# EAGLE design Encoder (EAGLE 6.5.0)
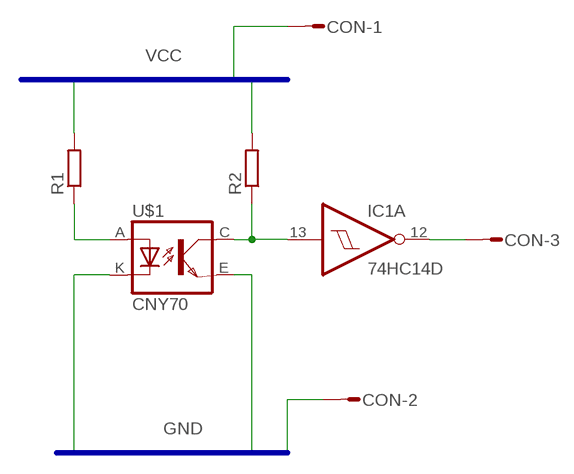
[diagram p0: schematic, sheet 1]

## Parts
CON  L03P  [L03P]
IC1  74HC14D  [SO14]
R1  R-EU_M1206  [M1206]
R2  R-EU_M1206  [M1206]
U$1  CNY70  [4]

## Nets
GND: CON.2 U$1.E(EMI) U$1.K(C)
N$1: R1.1 U$1.A
N$2: IC1.13(A:I) R2.1 U$1.C(COL)
N$3: CON.3 IC1.12(A:O)
VCC: CON.1 R1.2 R2.2
Unconnected: IC1.1(D:I) IC1.2(D:O) IC1.3(E:I) IC1.4(E:O) IC1.5(F:I) IC1.6(F:O) IC1.8(C:O) IC1.9(C:I) IC1.10(B:O) IC1.11(B:I)

## Buses
VCC
GND

## Power pins joined to a net without a drawn wire
GND: IC1.7(P:GND)
VCC: IC1.14(P:VCC)

## Library data of the parts
CON = con-amp-mt:L03P: AMP MT CONNECTOR
IC1 = 74xx-eu:74*14: Hex schmitt trigger INVERTER
R1 R2 = rcl:R-EU_: RESISTOR, European symbol
U$1 = cny70:CNY70

## Board
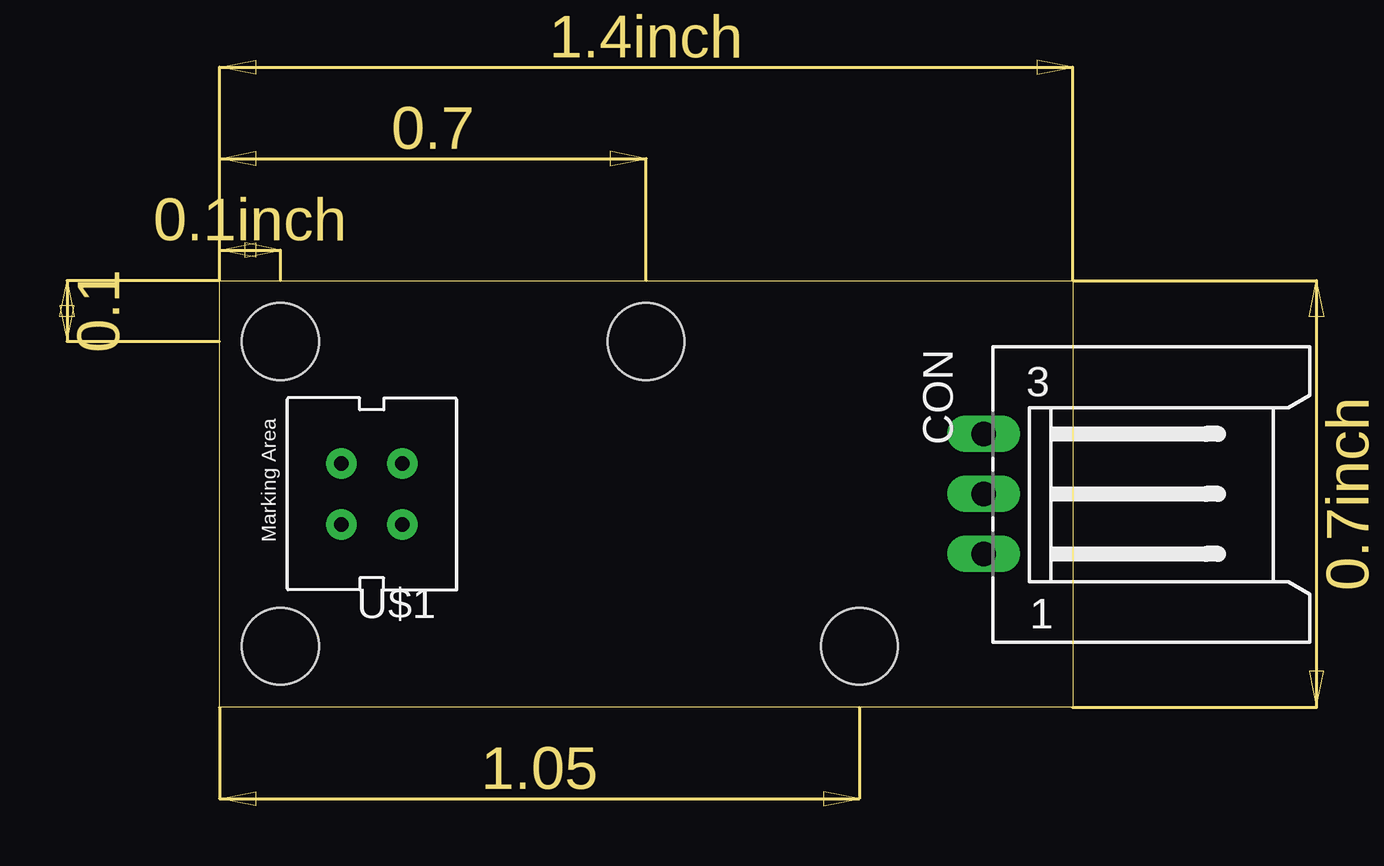
[diagram p1: board, top side]
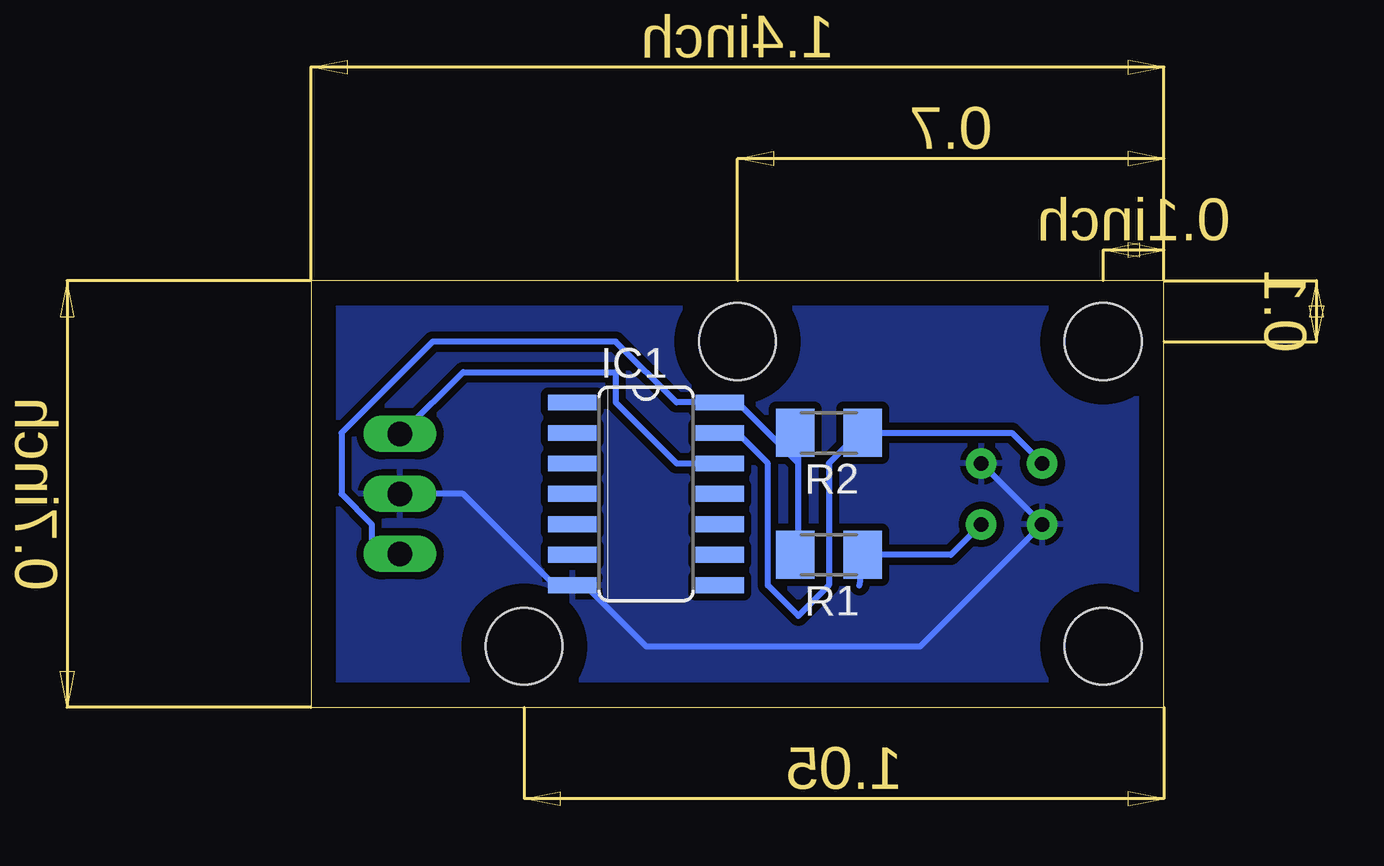
[diagram p2: board, bottom side, seen from below]

Size 35.56 x 17.78 mm. Coordinates in mm from the lower left corner, seen from the top.
Outline: 0,0 0,17.78 35.56,17.78 35.56,0 0,0
Copper layers (1*16): Top 0.035mm / dielectric 1.5mm / Bottom 0.035mm
Design rules "default": minimum track width 10mil, minimum drill 24mil, track to track 8mil, track to pad 8mil, pad to pad 8mil, via to via 8mil, smd to smd 8mil, copper to edge 40mil, drill to drill 8mil, minimum pad ring 10mil, minimum via ring 8mil, stop-mask expansion 4mil, vias tented up to drill 0mil, thermal gap 10mil
Holes 3.2 mm at 2.54,2.54 26.67,2.54 2.54,15.24 17.78,15.24

### Footprints (pad centres in the part's own frame; a part is rotated, then mirrored left to right if it is on the bottom)
L03P = drill 1.016 long: 1 2.5,-6.25; 2 0,-6.25; 3 -2.5,-6.25
SO14 = smd 0.66 x 2.032: 1 -3.81,-3.073; 2 -2.54,-3.073; 3 -1.27,-3.073; 4 0,-3.073; 5 1.27,-3.073; 6 2.54,-3.073; 7 3.81,-3.073; 8 3.81,3.073; 9 2.54,3.073; 10 1.27,3.073; 11 0,3.073; 12 -1.27,3.073; 13 -2.54,3.073; 14 -3.81,3.073
M1206 = smd 1.6 x 2: 1 -1.4,0; 2 1.4,0
4 = drill 0.61 pad 1.27: A -1.27,1.27; C 1.27,-1.27; E 1.27,1.27; K -1.27,-1.27

### Placement (x,y rotation side)
CON  38.1,8.89 270 top
IC1  21.59,8.89 270 bottom
R1  13.97,6.35 180 bottom
R2  13.97,11.43 180 bottom
U$1  6.35,8.89 180 top

### Tracks (layer width: path | path; a pad name or v marks a point on that pad's centre or on a via)
GND
  Bottom 0.254: U$1.K U$1.E 10.16,2.54 21.59,2.54 24.13,5.08 IC1.7 25.4,5.08 29.21,8.89 CON.2
  pour Bottom (isolate 0.305): 0,17.78 35.56,17.78 35.56,0 0,0
N$1
  Bottom 0.254: R1.1 12.7,5.08 | R1.1 8.89,6.35 U$1.A | 12.7,6.35 R1.1
N$2
  Bottom 0.254: IC1.13 17.78,11.43 16.51,10.16 16.51,5.08 15.24,3.81 13.97,5.08 13.97,10.16 12.7,11.43 R2.1 6.35,11.43 U$1.C
N$3
  Bottom 0.254: IC1.12 20.32,10.16 22.86,12.7 22.86,13.97 29.21,13.97 31.75,11.43 CON.3
VCC
  Bottom 0.254: 15.24,10.16 15.24,11.43 R2.2 | 15.24,10.16 15.24,6.35 R1.2 | 15.24,10.16 17.78,12.7 IC1.14 20.32,12.7 22.86,15.24 30.48,15.24 34.29,11.43 34.29,8.89 33.02,7.62 33.02,6.35 CON.1